# EAGLE design Nakaya Mainboard2 (EAGLE 9.6.2)
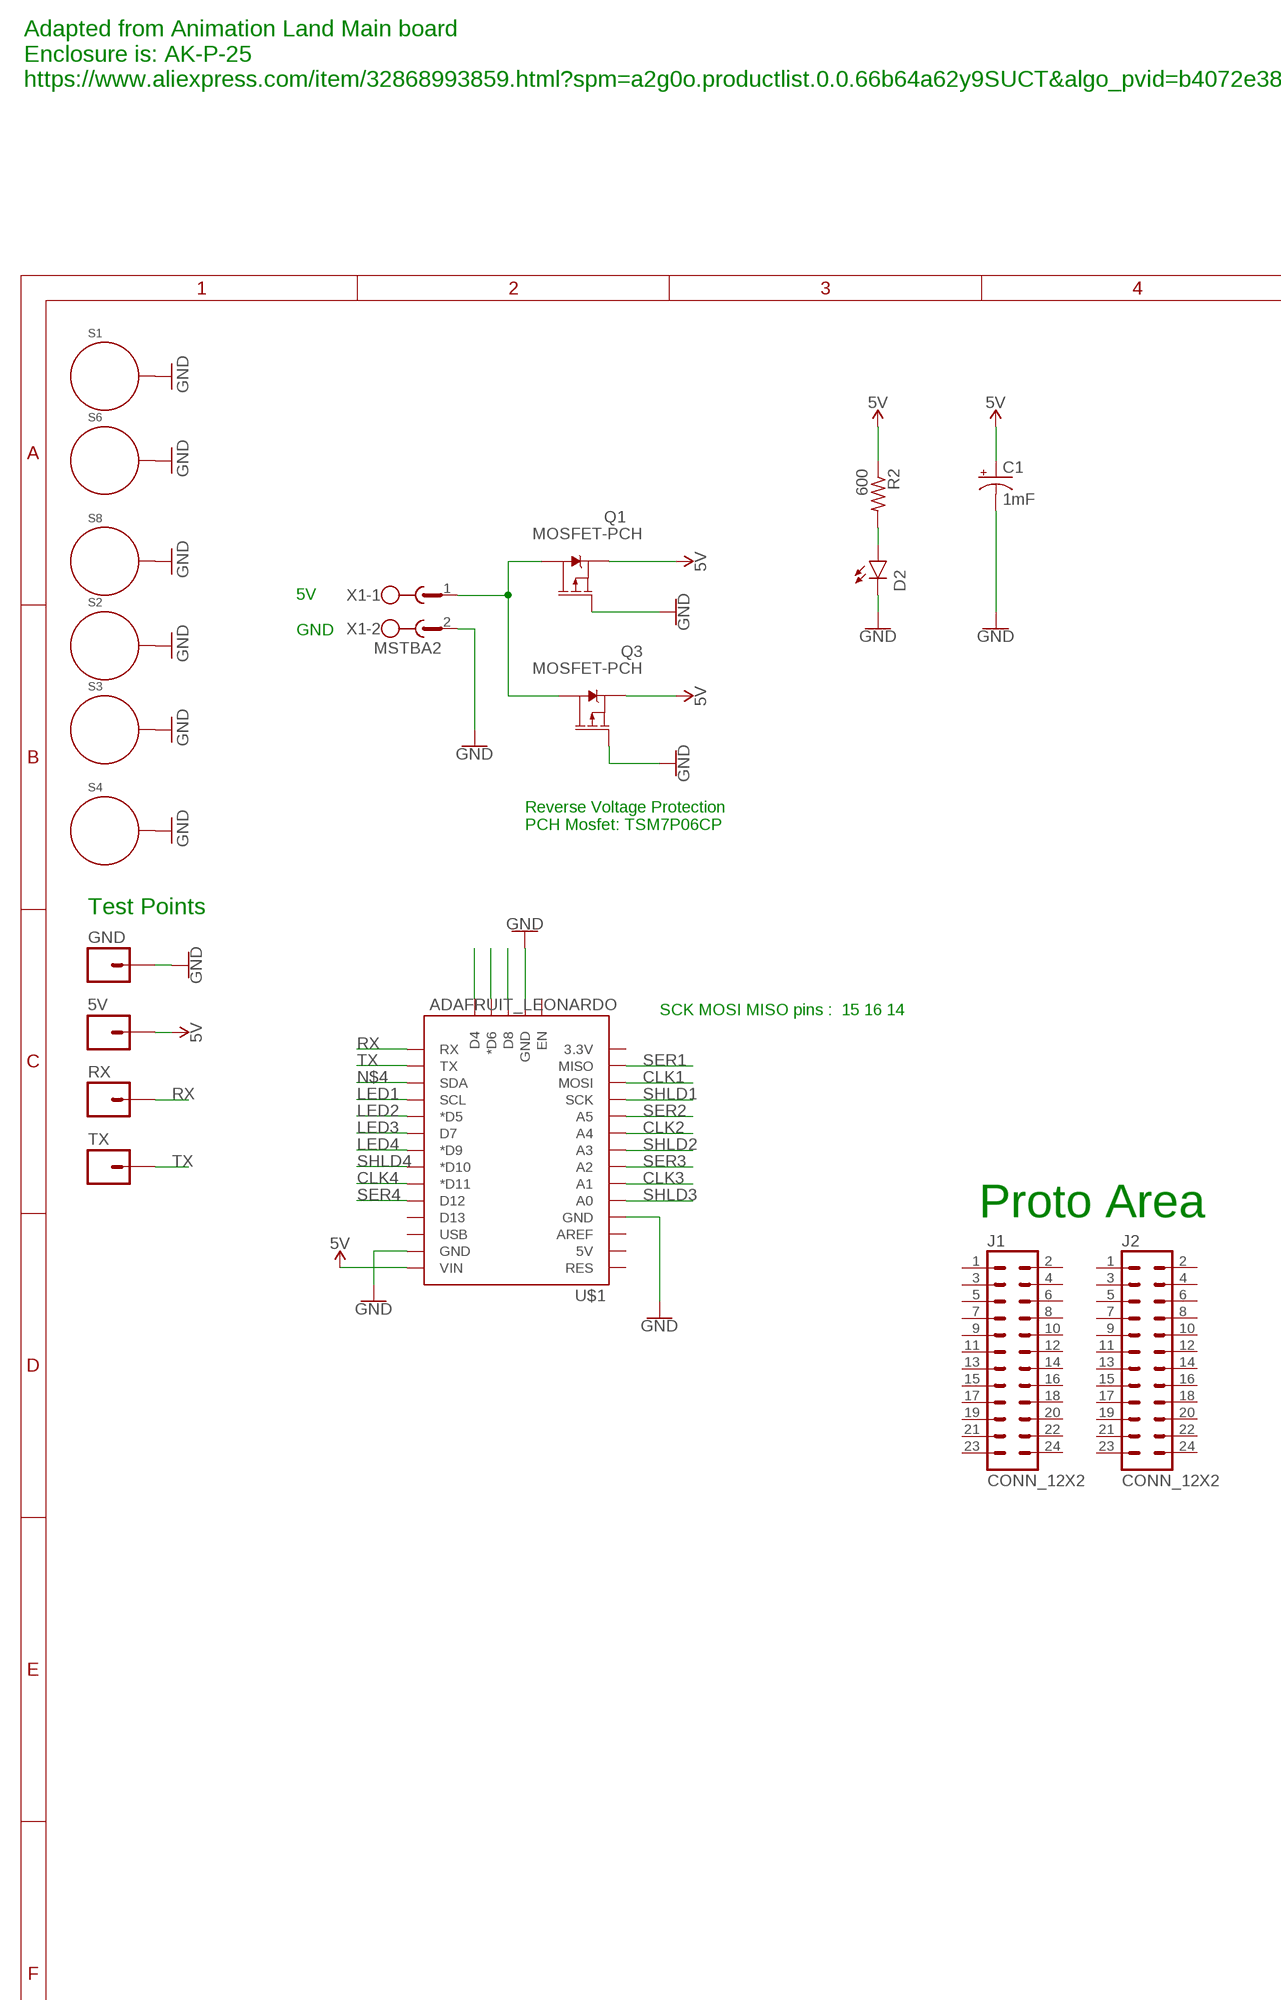
[diagram p0: schematic, sheet 1, part 1 of 2]
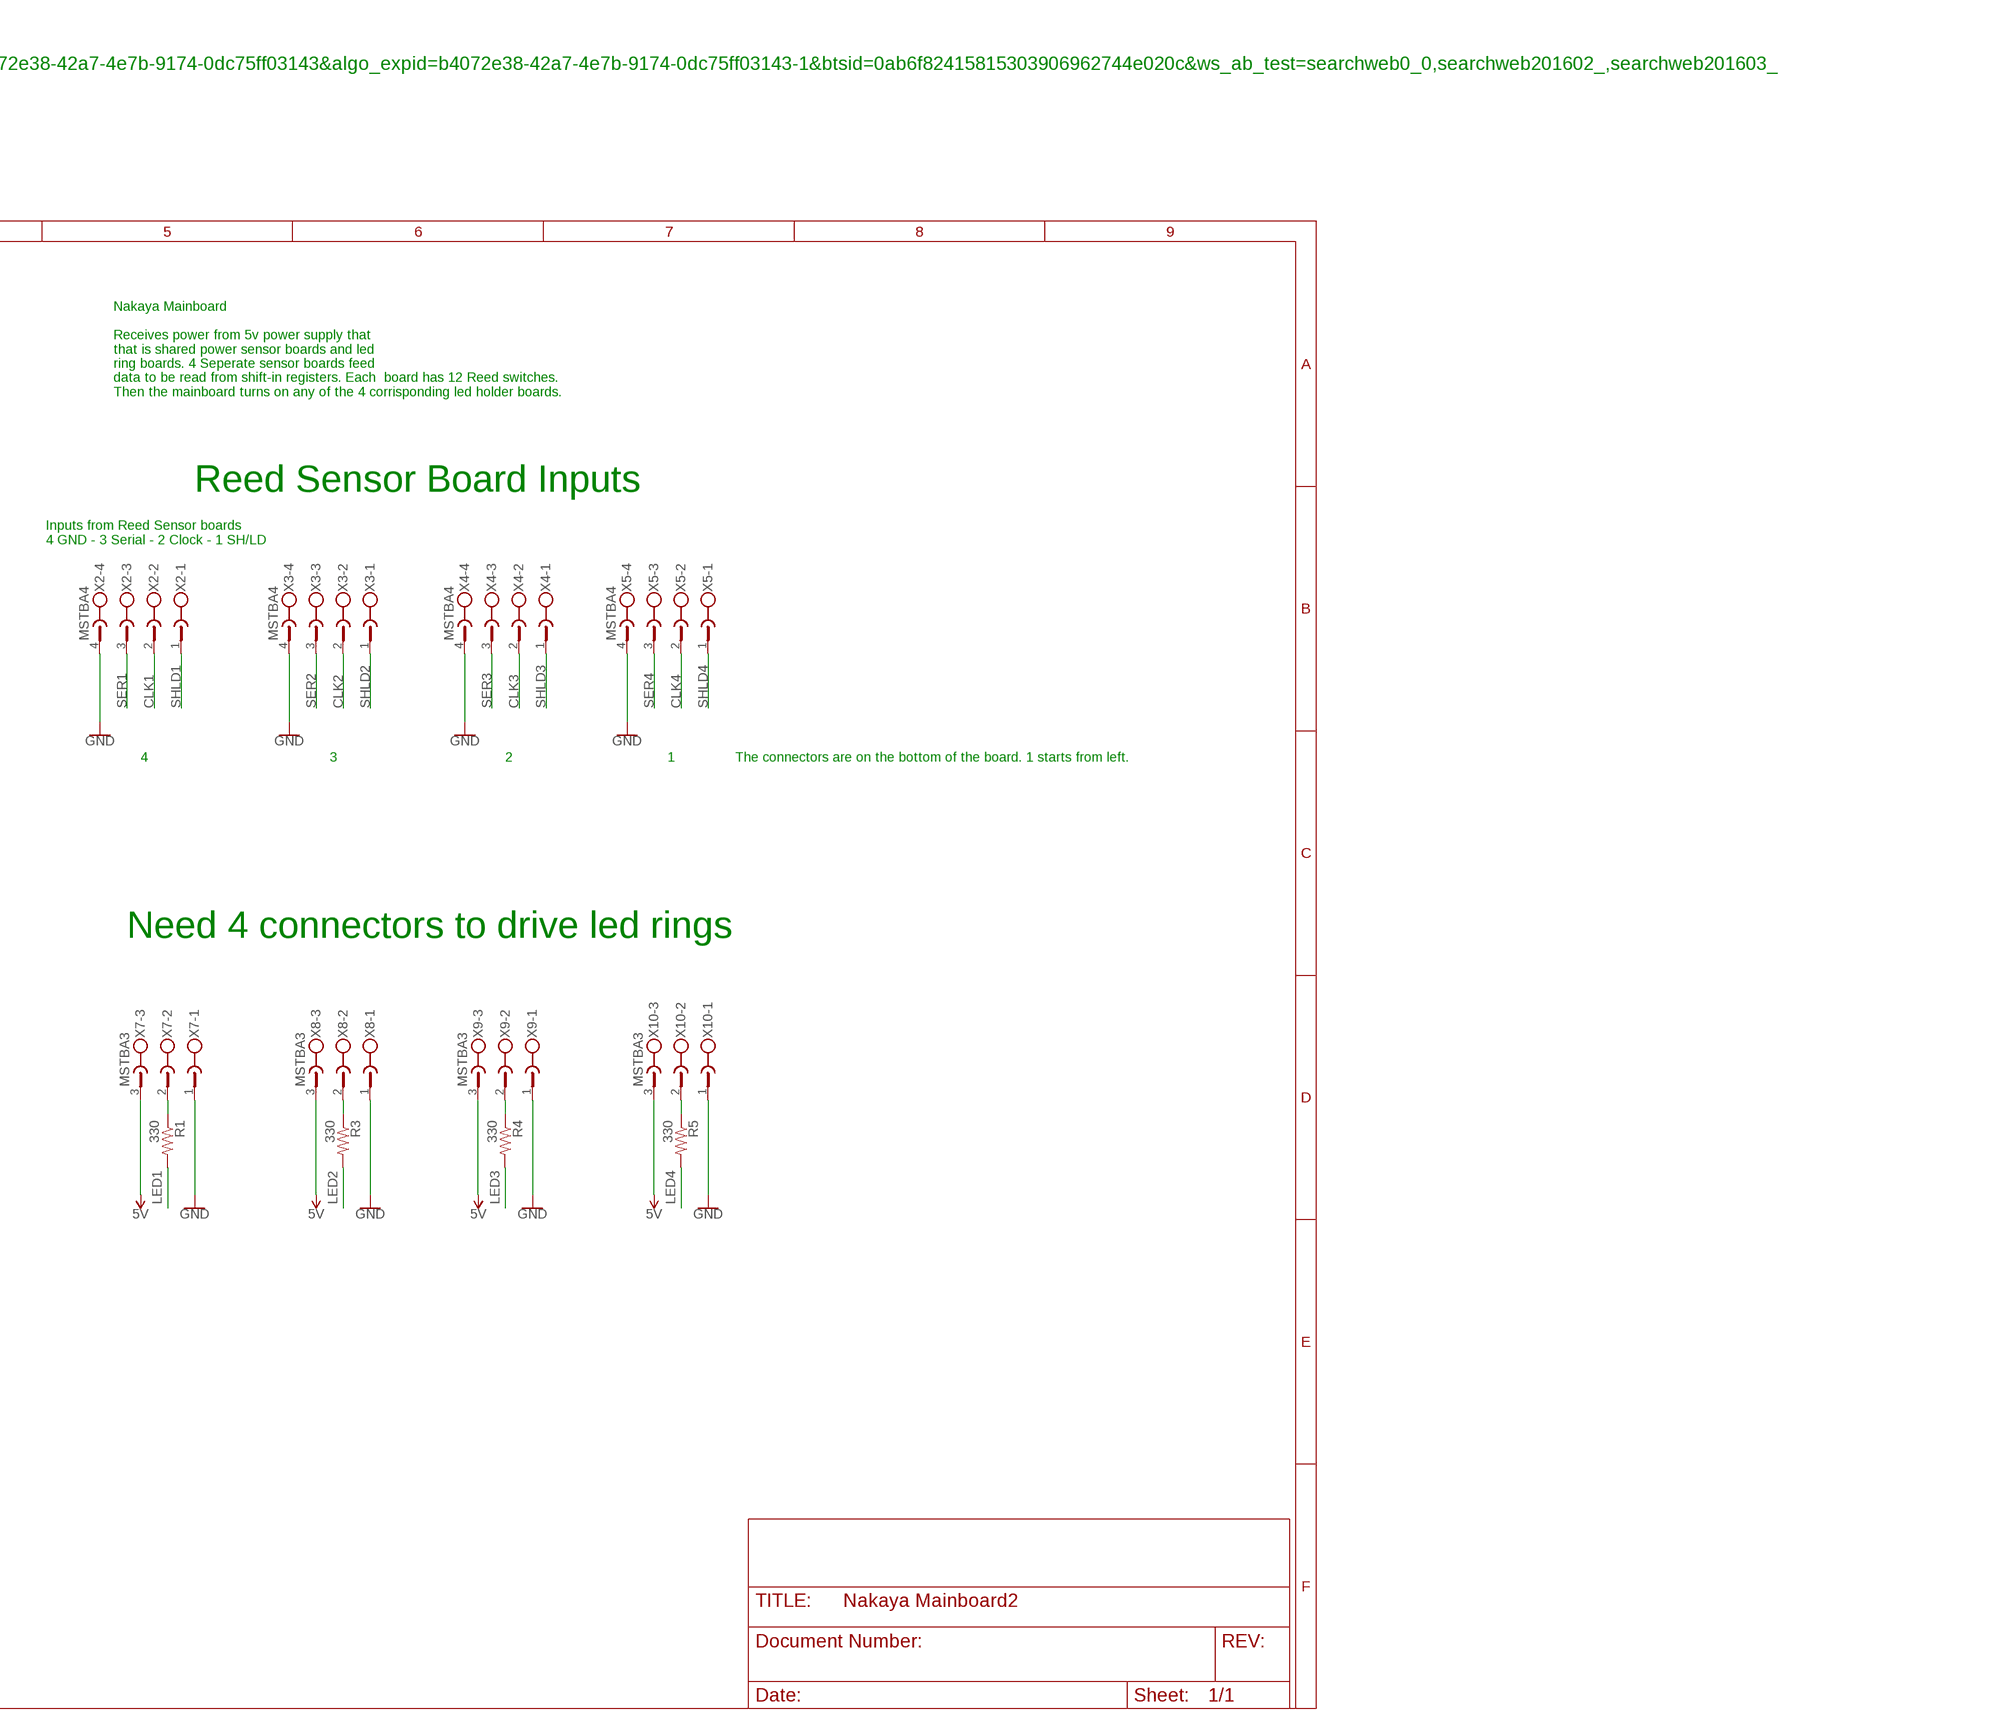
[diagram p1: schematic, sheet 1, part 2 of 2]

## Parts
5V  M01PTH  [1X01]
C1  1mF  1000UF-RADIAL-5MM-25V-20%  [CPOL-RADIAL-5MM-10MM]
D2  RED  SPARKFUN-LED_LED1206  [SPARKFUN-LED_LED-1206]
GND  M01PTH  [1X01]
J1  CONN_12X2  [2X12]
J2  CONN_12X2  [2X12]
Q1  MOSFET-PCH  [DPAK]
Q3  MOSFET-PCH  [DPAK]
R1  330  R-US_R0805  [R0805]
R2  600  R-US_R0805  [R0805]
R3  330  R-US_R0805  [R0805]
R4  330  R-US_R0805  [R0805]
R5  330  R-US_R0805  [R0805]
RX  M01PTH  [1X01]
S1  STANDOFF_ELECTRICAL5-32  [STANDOFF_ELECTRICAL_5_32]
S2  STANDOFF_ELECTRICAL5-32  [STANDOFF_ELECTRICAL_5_32]
S3  STANDOFF_ELECTRICAL5-32  [STANDOFF_ELECTRICAL_5_32]
S4  STANDOFF_ELECTRICAL5-32  [STANDOFF_ELECTRICAL_5_32]
S6  STANDOFF_ELECTRICAL5-32  [STANDOFF_ELECTRICAL_5_32]
S8  STANDOFF_ELECTRICAL5-32  [STANDOFF_ELECTRICAL_5_32]
TX  M01PTH  [1X01]
U$1  ADAFRUIT_LEONARDO  [ADAFRUIT_LENOARDO]
X1  MSTBA2  [MSTBA2]
X2  MSTBA4  [MSTBA4]
X3  MSTBA4  [MSTBA4]
X4  MSTBA4  [MSTBA4]
X5  MSTBA4  [MSTBA4]
X7  MSTBA3  [MSTBA3]
X8  MSTBA3  [MSTBA3]
X9  MSTBA3  [MSTBA3]
X10  MSTBA3  [MSTBA3]

## Nets
5V: 5V.1 C1.+ Q1.3(S) Q3.3(S) R2.1 U$1.VIN X7.3 X8.3 X9.3 X10.3
CLK1: U$1.MOSI X2.2
CLK2: U$1.A4 X3.2
CLK3: U$1.A1 X4.2
CLK4: U$1.D11(*D11) X5.2
GND: C1.- D2.C GND.1 Q1.1(G) Q3.1(G) S1.P1 S2.P1 S3.P1 S4.P1 S6.P1 S8.P1 U$1.GND@0(GND) U$1.GND@1(GND) U$1.GND@2(GND) X1.2 X2.4 X3.4 X4.4 X5.4 X7.1 X8.1 X9.1 X10.1
LED1: R1.2 U$1.SCL
LED2: R3.2 U$1.D5(*D5)
LED3: R4.2 U$1.D7
LED4: R5.2 U$1.D9(*D9)
N$3: D2.A R2.2
N$4: U$1.SDA
N$5: R1.1 X7.2
N$6: R3.1 X8.2
N$7: R4.1 X9.2
N$8: R5.1 X10.2
N$12: U$1.D4
N$19: Q1.4(D) Q3.4(D) X1.1
N$23: U$1.D6(*D6)
N$24: U$1.D8
RX: RX.1 U$1.RX
SER1: U$1.MISO X2.3
SER2: U$1.A5 X3.3
SER3: U$1.A2 X4.3
SER4: U$1.D12 X5.3
SHLD1: U$1.SCK X2.1
SHLD2: U$1.A3 X3.1
SHLD3: U$1.A0 X4.1
SHLD4: U$1.D10(*D10) X5.1
TX: TX.1 U$1.TX
Unconnected: J1.1 J1.2 J1.3 J1.4 J1.5 J1.6 J1.7 J1.8 J1.9 J1.10 J1.11 J1.12 J1.13 J1.14 J1.15 J1.16 J1.17 J1.18 J1.19 J1.20 J1.21 J1.22 J1.23 J1.24 J2.1 J2.2 J2.3 J2.4 J2.5 J2.6 J2.7 J2.8 J2.9 J2.10 J2.11 J2.12 J2.13 J2.14 J2.15 J2.16 J2.17 J2.18 J2.19 J2.20 J2.21 J2.22 J2.23 J2.24 U$1.3V(3.3V) U$1.5V U$1.AREF U$1.D13 U$1.EN U$1.RES U$1.USB

## Notes on the sheet
- Adapted from Animation Land Main board
  Enclosure is: AK-P-25
  https://www.aliexpress.com/item/32868993859.html?spm=a2g0o.productlist.0.0.66b64a62y9SUCT&algo_pvid=b4072e38-42a7-4e7b-9174-0dc75ff03143&algo_expid=b4072e38-42a7-4e7b-9174-0dc75ff03143-1&btsid=0ab6f82415815303906962744e020c&ws_ab_test=searchweb0_0,searchweb201602_,searchweb201603_
- Nakaya Mainboard
  
  Receives power from 5v power supply that
  that is shared power sensor boards and led
  ring boards. 4 Seperate sensor boards feed
  data to be read from shift-in registers. Each  board has 12 Reed switches.
  Then the mainboard turns on any of the 4 corrisponding led holder boards.
- Reed Sensor Board Inputs
- 5V
  
  GND
- Inputs from Reed Sensor boards
  4 GND - 3 Serial - 2 Clock - 1 SH/LD
- Reverse Voltage Protection
  PCH Mosfet: TSM7P06CP
- Test Points
- 4 | 3 | 2 | 1 | The connectors are on the bottom of the board. 1 starts from left.
- SCK MOSI MISO pins :  15 16 14
- Need 4 connectors to drive led rings
- Proto Area

## Library data of the parts
5V GND RX TX = SparkFun-Connectors:M01: Header 1 Standard 1-pin 0.1" header. Use with straight break away headers (SKU : PRT-00116), right angle break away headers (PRT-00553), swiss pins (PRT-00743), machine pins (PRT-00117), and female headers (PRT-00115). SMTSO-256-ET is a "flush mount" nut for a 4-40 screw. The older package used to be too tight, and did not allow it to sit properly thru the drill hit. The latest (0.165DIA) fits nice and snug.
C1 = th_libraries:1000UF: 1,000µF/1mF ceramic capacitors A capacitor is a passive two-terminal electrical component used to store electrical energy temporarily in an electric field. CAP-08070; PROD_ID: CAP-09538
D2 = th_libraries:SPARKFUN-LED_LED: LED (Generic) Standard schematic elements and footprints for 5mm, 3mm, 1206, and 0603 sized LEDs. Generic LEDs with no color specified.
J1 J2 = SparkFun-Connectors:CONN_12X2: Multi connection point. Often used as Generic Header-pin footprint for 0.1 inch spaced/style header connections On any of the 0.1 inch spaced packages, you can populate with these: Break Away Headers - Straight <https://www.sparkfun.com/products/116> (PRT-00116) Break Away Male Headers - Right Angle <https://www.sparkfun.com/products/553> (PRT-00553) Female Headers <https://www.sparkfun.com/products/115> (PRT-00115) Break Away Headers - Machine Pin <https://www.sparkfun.com/products/117> (PRT-00117) Break Away Female Headers - Swiss Machine Pin <https://www.sparkfun.com/products/743> (PRT-00743)
Q1 Q3 = th_libraries:MOSFET-PCH: MOSFET-PCH
R1-R5 = rcl:R-US_: RESISTOR, American symbol; SPICEPREFIX: R
S1-S4 S6 S8 = th_libraries:STANDOFF_ELECTRICAL: A standoff intended to be an electrically connected point. Pad size and stop size allow for a #8 Phillips pan screw head to make a solid connection to the board. Added 144mill drill hole that fits my normal wood screw
U$1 = th_libraries:ADAFRUIT_LEONARDO: Adafruit ItsyBitsy 32u4 - 5V 16MHz https://www.adafruit.com/product/3677
X1 = th_libraries:MSTBA2: PHOENIX; MF: FARNELL; MPN: 1757242; OC_FARNELL: 3705171; OC_NEWARK: 71C4161
X2-X5 = th_libraries:MSTBA4: PHOENIX; MF: FARNELL; MPN: 1757268; OC_FARNELL: 3705195; OC_NEWARK: 71C4163
X7-X10 = th_libraries:MSTBA3: PHOENIX; MF: FARNELL; MPN: 1757255; OC_FARNELL: 3705183; OC_NEWARK: 71C4162

## Board
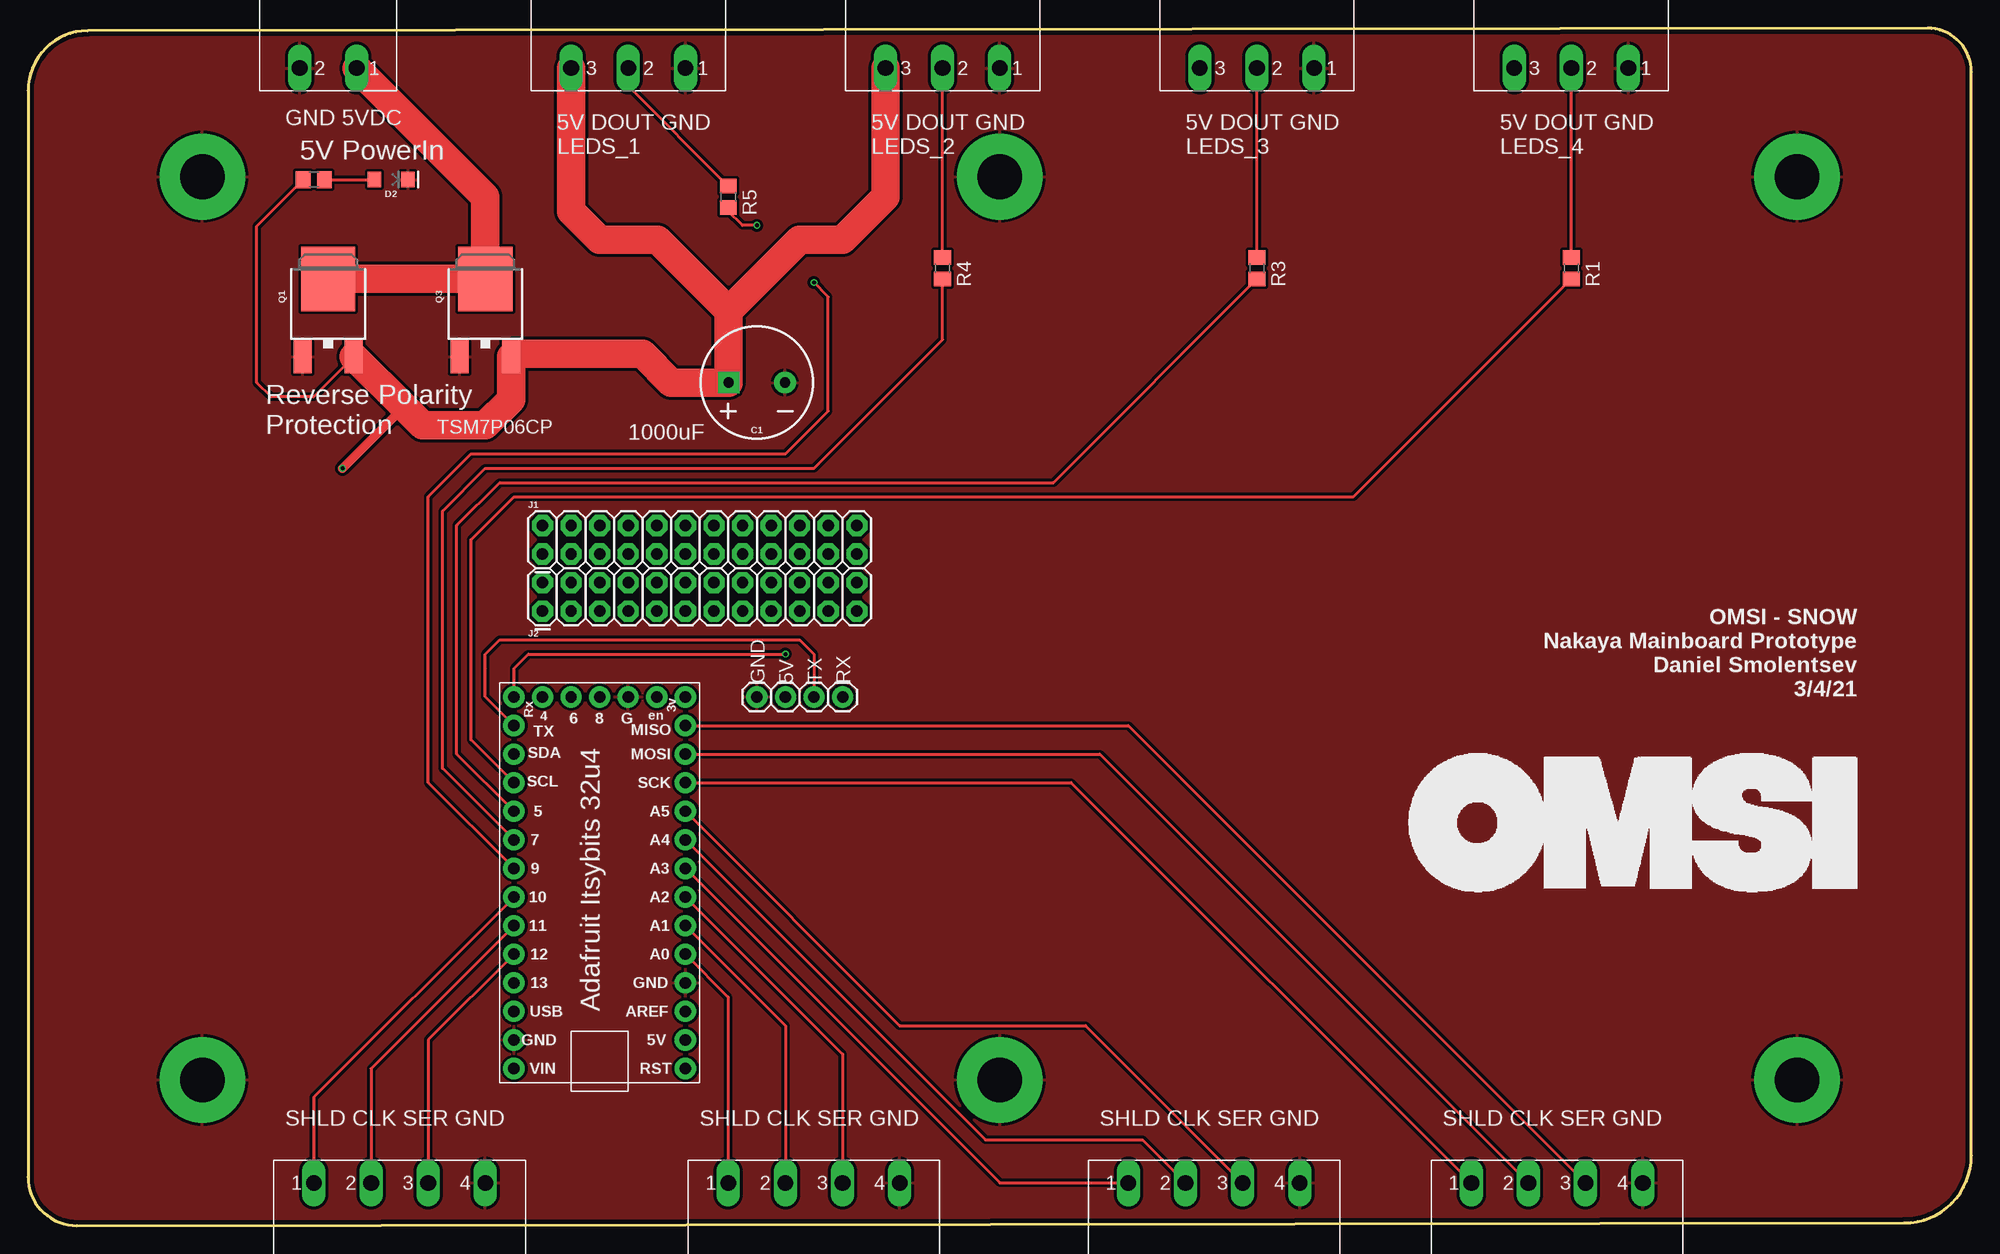
[diagram p2: board, top side]
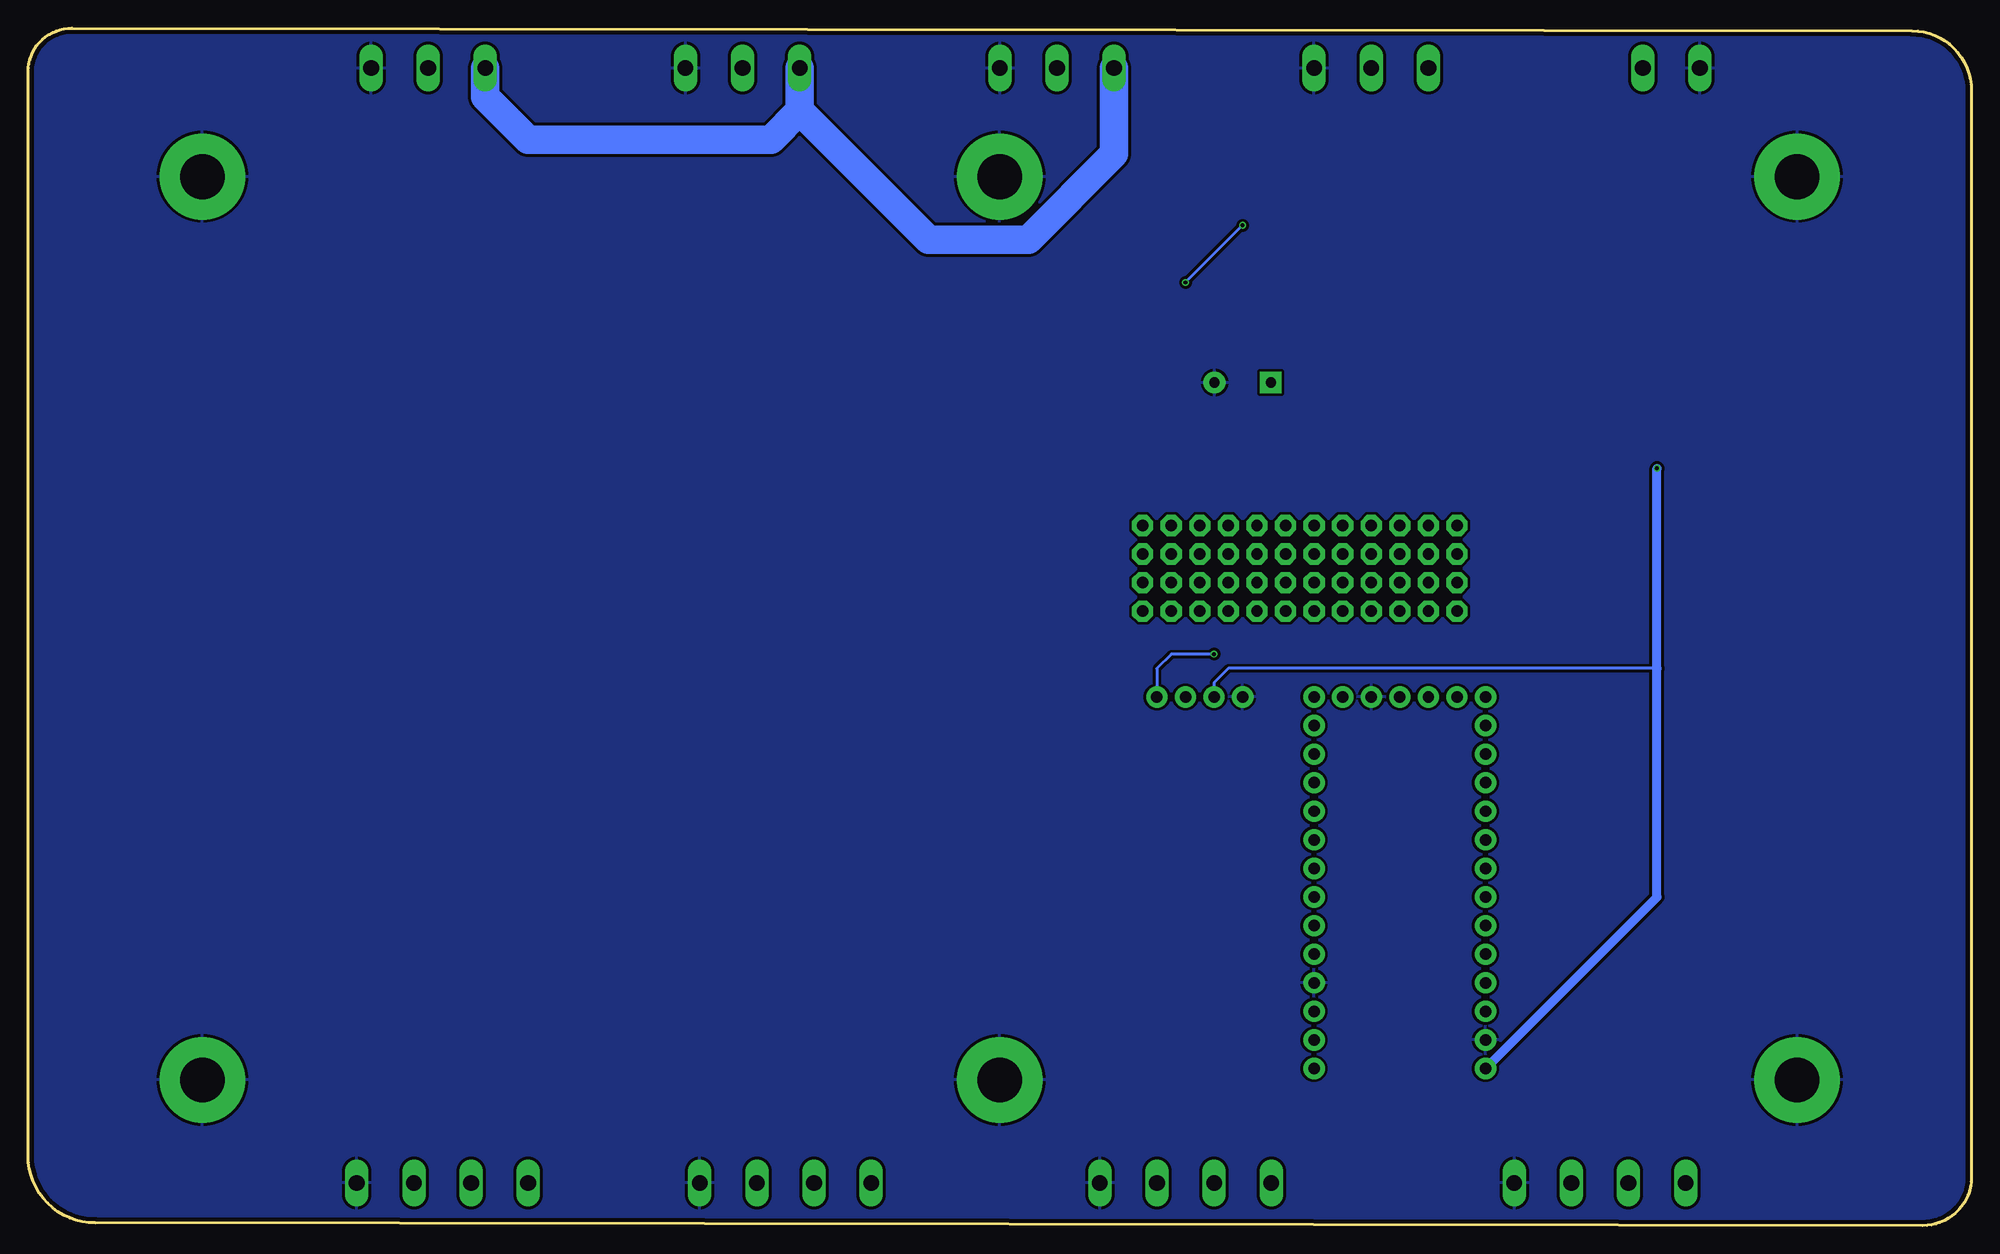
[diagram p3: board, bottom side, seen from below]

Size 172.72 x 106.41 mm. Coordinates in mm from the lower left corner, seen from the top.
Outline: 168.83,106.41 5.28,106.17 arc90 0,100.89 0,4.33 arc90 4.33,0 166.75,0.24 arc90 172.72,6.22 172.72,102.53 arc90 168.83,106.41
Copper layers (1*16): Top 0.035559375mm / dielectric 1.6mm / Bottom 0.035559375mm
Design rules "oshpark-2layer (1) *": minimum track width 10mil, minimum drill 10mil, track to track 8mil, track to pad 8mil, pad to pad 8mil, via to via 8mil, smd to smd 8mil, copper to edge 15mil, drill to drill 6mil, minimum pad ring 5mil, minimum via ring 5mil, stop-mask expansion 2.5mil, vias tented up to drill 25mil, thermal gap 10mil

### Footprints (pad centres in the part's own frame; a part is rotated, then mirrored left to right if it is on the bottom)
1X01 = drill 1.016 pad 1.88: 1 0,0
CPOL-RADIAL-5MM-10MM = drill 0.9 pad 1.93 square: + 2.5,0 | drill 0.9 pad 1.93: - -2.5,0
SPARKFUN-LED_LED-1206 = smd 1.2 x 1.4: A -1.5,0; C 1.5,0
2X12 = drill 1.016 pad 1.88 octagon: 1 0,0; 2 0,2.54; 3 2.54,0; 4 2.54,2.54; 5 5.08,0; 6 5.08,2.54; 7 7.62,0; 8 7.62,2.54; 9 10.16,0; 10 10.16,2.54; 11 12.7,0; 12 12.7,2.54; 13 15.24,0; 14 15.24,2.54; 15 17.78,0; 16 17.78,2.54; 17 20.32,0; 18 20.32,2.54; 19 22.86,0; 20 22.86,2.54; 21 25.4,0; 22 25.4,2.54; 23 27.94,0; 24 27.94,2.54
DPAK = smd 1.6 x 3: 1 -2.28,-5.31; 3 2.28,-5.31 | smd 4.826 x 5.715: 4 0,1.588
R0805 = smd 1.3 x 1.5: 1 -0.95,0; 2 0.95,0
STANDOFF_ELECTRICAL_5_32 = drill 3.969 pad 7.62: P1 0,0
ADAFRUIT_LENOARDO = drill 1.016 pad 1.88: 3V -10.16,-21.59; 5V -10.16,8.89; A0 -10.16,1.27; A1 -10.16,-1.27; A2 -10.16,-3.81; A3 -10.16,-6.35; A4 -10.16,-8.89; A5 -10.16,-11.43; AREF -10.16,6.35; D4 2.54,-21.59; D5 5.08,-11.43; D6 0,-21.59; D7 5.08,-8.89; D8 -2.54,-21.59; D9 5.08,-6.35; D10 5.08,-3.81; D11 5.08,-1.27; D12 5.08,1.27; D13 5.08,3.81; EN -7.62,-21.59; GND@0 -10.16,3.81; GND@1 -5.08,-21.59; GND@2 5.08,8.89; MISO -10.16,-19.05; MOSI -10.16,-16.51; RES -10.16,11.43; RX 5.08,-21.59; SCK -10.16,-13.97; SCL 5.08,-13.97; SDA 5.08,-16.51; TX 5.08,-19.05; USB 5.08,6.35; VIN 5.08,11.43
MSTBA2 = drill 1.397 long: 1 -2.54,5.08; 2 2.54,5.08
MSTBA4 = drill 1.397 long: 1 -7.62,5.08; 2 -2.54,5.08; 3 2.54,5.08; 4 7.62,5.08
MSTBA3 = drill 1.397 long: 1 -5.08,5.08; 2 0,5.08; 3 5.08,5.08

### Placement (x,y rotation side)
5V  67.31,46.98 90 top
C1  64.77,74.92 180 top
D2  32.26,92.96 0 top
GND  64.77,46.98 90 top
J1  45.72,59.68 0 top
J2  45.72,54.6 0 top
Q1  26.67,82.54 0 top
Q3  40.64,82.54 0 top
R1  137.16,85.08 270 top
R2  25.4,92.96 0 top
R3  109.22,85.08 270 top
R4  81.28,85.08 270 top
R5  62.23,91.43 270 top
RX  72.39,46.98 90 top
S1  15.49,93.21 0 top
S2  86.36,93.21 0 top
S3  157.23,12.95 0 top
S4  157.23,93.21 0 top
S6  86.36,12.95 0 top
S8  15.49,12.95 0 top
TX  69.85,46.98 90 top
U$1  48.26,25.39 180 top
X1  26.67,107.94 180 top
X2  135.89,-1.28 0 top
X3  105.41,-1.28 0 top
X4  69.85,-1.28 0 top
X5  33.02,-1.28 0 top
X7  137.16,107.94 180 top
X8  109.22,107.94 180 top
X9  81.28,107.94 180 top
X10  53.34,107.94 180 top

### Tracks (layer width: path | path; a pad name or v marks a point on that pad's centre or on a via)
5V  (via drill 0.35)
  Top 0.254: Q1.3 25.37,73.65 21.59,73.65 20.32,74.92 20.32,88.83 R2.1
  Top 0.813: v27.94,67.3 33.41,72.77
  Top 1.905: Q3.3 43.15,77.46
  Top 2.54: Q1.3 33.41,72.77 35.07,71.11 40.64,71.11 42.92,73.39 Q3.3 | 62.27,81.31 C1.+ 57.15,74.92 54.61,77.46 43.15,77.46 | 62.27,81.31 55.96,87.62 50.8,87.62 48.26,90.16 X10.3 | 62.27,81.31 68.58,87.62 72.39,87.62 76.2,91.43 X9.3
  Bottom 0.254: 27.94,49.52 66.04,49.52 67.31,48.25 5V.1
  Bottom 0.813: U$1.VIN 27.94,29.2 27.94,49.52 v27.94,67.3
  Bottom 2.54: X8.3 104.14,99.05 | 104.14,99.05 92.71,87.62 83.82,87.62 76.2,95.24 X9.3 | 104.14,99.05 106.68,96.51 128.27,96.51 132.08,100.32 X7.3
CLK1
  Top 0.254: U$1.MOSI 95.25,41.9 X2.2
CLK2
  Top 0.254: U$1.A4 85.09,7.61 99.06,7.61 X3.2
CLK3
  Top 0.254: U$1.A1 67.31,17.77 X4.2
CLK4
  Top 0.254: U$1.D11 30.48,13.96 X5.2
GND
  pour Top (isolate 0.254): 0,107.94 173.25,107.94 173.25,1.79 170.18,-1.28 3.59,-1.28 arc-45 1.8,-0.53 0,1.26
  pour Bottom (isolate 0.254): 2.01,107.42 174.52,107.42 174.52,4.33 168.91,-1.28 4.86,-1.28 arc-45 3.07,-0.53 0,2.53 0,104.35 arc-45 0.74,106.15
LED1
  Top 0.254: U$1.SCL 39.37,43.17 39.37,60.95 43.18,64.76 117.79,64.76 R1.2
LED2
  Top 0.254: U$1.D5 38.1,41.9 38.1,62.22 41.91,66.03 91.12,66.03 R3.2
LED3
  Top 0.254: U$1.D7 36.83,40.63 36.83,63.49 40.64,67.3 69.85,67.3 81.28,78.73 R4.2
LED4  (via drill 0.35)
  Top 0.254: U$1.D9 35.56,39.36 35.56,64.76 39.37,68.57 67.31,68.57 71.12,72.38 71.12,82.54 v69.85,83.81 | v64.77,88.89 63.5,88.89 62.23,90.16 R5.2
  Bottom 0.254: v69.85,83.81 v64.77,88.89
N$3
  Top 0.254: R2.2 D2.A
N$5
  Top 0.254: R1.1 X7.2
N$6
  Top 0.254: R3.1 X8.2
N$7
  Top 0.254: R4.1 X9.2
N$8
  Top 0.254: R5.1 53.34,101.27 X10.2
N$19
  Top 2.54: Q1.4 Q3.4 40.64,91.43 X1.1
RX  (via drill 0.35)
  Top 0.254: U$1.RX 43.18,49.52 44.45,50.79 v67.31,50.79
  Bottom 0.254: v67.31,50.79 71.12,50.79 72.39,49.52 RX.1
SER1
  Top 0.254: U$1.MISO 97.79,44.44 X2.3
SER2
  Top 0.254: U$1.A5 77.47,17.77 93.98,17.77 X3.3
SER3
  Top 0.254: U$1.A2 72.39,15.23 X4.3
SER4
  Top 0.254: U$1.D12 35.56,16.5 X5.3
SHLD1
  Top 0.254: U$1.SCK 92.71,39.36 X2.1
SHLD2
  Top 0.254: U$1.A3 86.36,3.8 X3.1
SHLD3
  Top 0.254: U$1.A0 62.23,20.31 X4.1
SHLD4
  Top 0.254: U$1.D10 25.4,11.42 X5.1
TX
  Top 0.254: U$1.TX 40.64,46.98 40.64,49.52 40.64,50.79 41.91,52.06 68.58,52.06 69.85,50.79 TX.1

### Text on the board
tPlace: 5V PowerIn | Reverse Polarity / Protection | TSM7P06CP | LED PNL2 | Relay | Adafruit Itsybits 32u4 | Wav / Trigger | G NC Signal | G T1 T2 12V
tNames: GND 5VDC | 5V DOUT GND / LEDS_1 | 5V DOUT GND / LEDS_2 | 5V DOUT GND / LEDS_3 | 5V DOUT GND / LEDS_4 | 1000uF | OMSI - SNOW / Nakaya Mainboard Prototype / Daniel Smolentsev / 3/4/21 | SHLD CLK SER GND | SHLD CLK SER GND | SHLD CLK SER GND | SHLD CLK SER GND